# Altium schematic sheet Schematic01.SchDoc
size A; SheetNumber: 1; SheetTotal: 2
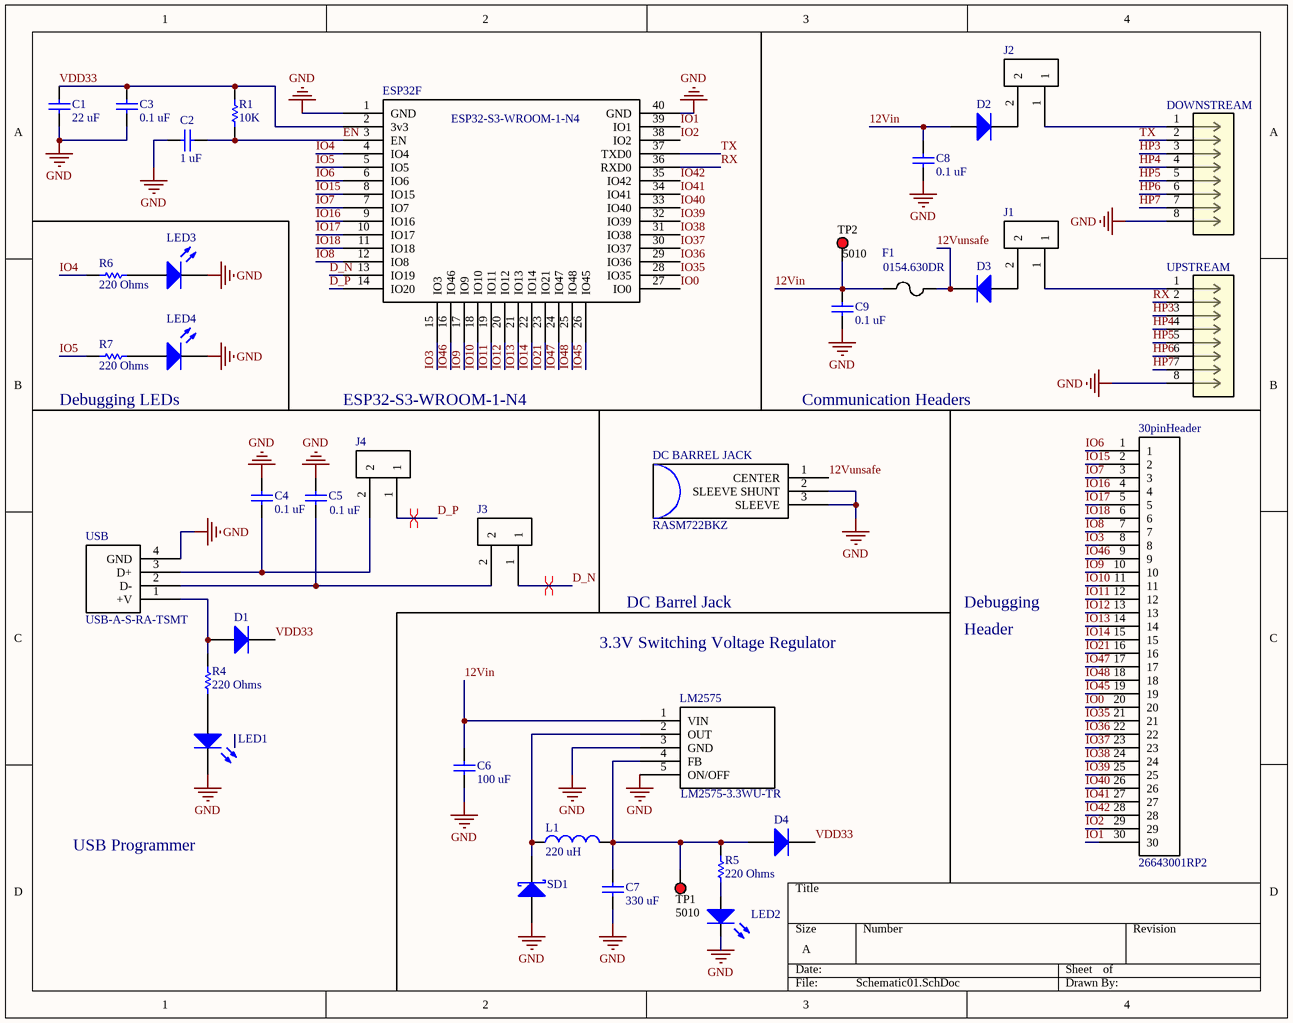
[diagram p0: Schematic01.SchDoc]

## Parts
30pinHeader  26643001RP2
C1  value 22 uF
C2  value 1 uF  (hidden comment: Capacitor)
C3  value 0.1 uF  (hidden comment: Capacitor)
C4  value 0.1 uF  (hidden comment: Capacitor)
C5  value 0.1 uF  (hidden comment: Capacitor)
C6  value 100 uF  (hidden comment: Capacitor)
C7  value 330 uF  (hidden comment: Capacitor)
C8  value 0.1 uF  (hidden comment: Capacitor)
C9  value 0.1 uF  (hidden comment: Capacitor)
D1  Diode  (value not drawn)
D2  Diode  (value not drawn)
D3  Diode  (value not drawn)
D4  Diode  (value not drawn)
DC_BARREL_JACK  RASM722BKZ
DOWNSTREAM  702460801  [CONN_7024608xx_MOL]  (value not drawn)
ESP32F  ESP32-S3-WROOM-1-N4  (value not drawn)
F1  0154.630DR  [0154Series_LTF]
J1  26640201RP2  (value not drawn)
J2  26640201RP2  (value not drawn)
J3  26640201RP2  (value not drawn)
J4  26640201RP2  (value not drawn)
L1  value 220 uH  (hidden comment: Inductor)
LED1  Light-Emitting Diode  (value not drawn)
LED2  Light-Emitting Diode  (value not drawn)
LED3  Light-Emitting Diode  (value not drawn)
LED4  Light-Emitting Diode  (value not drawn)
LM2575  LM2575-3.3WUTR  (value not drawn)
R1  value 10K  (hidden comment: Resistor)
R4  value 220 Ohms  (hidden comment: Resistor)
R5  value 220 Ohms  (hidden comment: Resistor)
R6  value 220 Ohms  (hidden comment: Resistor)
R7  value 220 Ohms  (hidden comment: Resistor)
SD1  Schottky Diode  (value not drawn)
TP1  5010  [KSTN-5010_V]
TP2  5010  [KSTN-5010_V]
UPSTREAM  702460801  [CONN_7024608xx_MOL]  (value not drawn)
USB  USB-A-S-RA-TSMT

## Nets
GND: C1.1 C2.1 C3.1 C4.2 C5.2 C6.1 C7.1 C8.1 C9.1 DC_BARREL_JACK.2(SLEEVE_SHUNT) DC_BARREL_JACK.3(SLEEVE) DOWNSTREAM.8 ESP32F.1(GND) ESP32F.40(GND) LED1.2(K) LED2.2(K) LED3.2(K) LED4.2(K) LM2575.3(GND) LM2575.5(ON/OFF) SD1.1(A) UPSTREAM.8 USB.4(GND)
12Vin: C6.2 C8.2 C9.2 D2.1(A) F1.1 LM2575.1(VIN) TP2.1
12Vunsafe: D3.2(K) DC_BARREL_JACK.1(CENTER) F1.2
D_N: ESP32F.13(IO19) J3.1
D_P: ESP32F.14(IO20) J4.1
EN: C2.2 ESP32F.3(EN) R1.1
HP3: DOWNSTREAM.3 UPSTREAM.3
HP4: DOWNSTREAM.4 UPSTREAM.4
HP5: DOWNSTREAM.5 UPSTREAM.5
HP6: DOWNSTREAM.6 UPSTREAM.6
HP7: DOWNSTREAM.7 UPSTREAM.7
IO0: 30pinHeader.20 ESP32F.27(IO0)
IO1: 30pinHeader.30 ESP32F.39(IO1)
IO2: 30pinHeader.29 ESP32F.38(IO2)
IO3: 30pinHeader.8 ESP32F.15(IO3)
IO4: ESP32F.4(IO4) R6.1
IO5: ESP32F.5(IO5) R7.1
IO6: 30pinHeader.1 ESP32F.6(IO6)
IO7: 30pinHeader.3 ESP32F.7(IO7)
IO8: 30pinHeader.7 ESP32F.12(IO8)
IO9: 30pinHeader.10 ESP32F.17(IO9)
IO10: 30pinHeader.11 ESP32F.18(IO10)
IO11: 30pinHeader.12 ESP32F.19(IO11)
IO12: 30pinHeader.13 ESP32F.20(IO12)
IO13: 30pinHeader.14 ESP32F.21(IO13)
IO14: 30pinHeader.15 ESP32F.22(IO14)
IO15: 30pinHeader.2 ESP32F.8(IO15)
IO16: 30pinHeader.4 ESP32F.9(IO16)
IO17: 30pinHeader.5 ESP32F.10(IO17)
IO18: 30pinHeader.6 ESP32F.11(IO18)
IO21: 30pinHeader.16 ESP32F.23(IO21)
IO35: 30pinHeader.21 ESP32F.28(IO35)
IO36: 30pinHeader.22 ESP32F.29(IO36)
IO37: 30pinHeader.23 ESP32F.30(IO37)
IO38: 30pinHeader.24 ESP32F.31(IO38)
IO39: 30pinHeader.25 ESP32F.32(IO39)
IO40: 30pinHeader.26 ESP32F.33(IO40)
IO41: 30pinHeader.27 ESP32F.34(IO41)
IO42: 30pinHeader.28 ESP32F.35(IO42)
IO45: 30pinHeader.19 ESP32F.26(IO45)
IO46: 30pinHeader.9 ESP32F.16(IO46)
IO47: 30pinHeader.17 ESP32F.24(IO47)
IO48: 30pinHeader.18 ESP32F.25(IO48)
RX: ESP32F.36(RXD0) UPSTREAM.2
TX: DOWNSTREAM.2 ESP32F.37(TXD0)
VDD33: C1.2 C3.2 D1.2(K) D4.2(K) ESP32F.2(3v3) R1.2
NetC4_1: C4.1 J4.2 USB.3(D+)
NetC5_1: C5.1 J3.2 USB.2(D-)
NetC7_2: C7.2 D4.1(A) L1.2 LM2575.4(FB) R5.2 TP1.1
NetD1_1: D1.1(A) R4.2 USB.1(+V)
NetD2_2: D2.2(K) J2.2
NetD3_1: D3.1(A) J1.2
NetDOWNSTREAM_1: DOWNSTREAM.1 J2.1
NetJ1_1: J1.1 UPSTREAM.1
NetL1_1: L1.1 LM2575.2(OUT) SD1.2(K)
NetLED1_1: LED1.1(A) R4.1
NetLED2_1: LED2.1(A) R5.1
NetLED3_1: LED3.1(A) R6.2
NetLED4_1: LED4.1(A) R7.2

## Layout directives
differential pair: D_N, D_P

## Notes on the sheet
- Debugging LEDs
- ESP32-S3-WROOM-1-N4
- Communication Headers
- DC Barrel Jack
- Debugging
- Header
- 3.3V Switching Voltage Regulator
- USB Programmer

## Library data of the parts
30pinHeader = CMP-00006-1: Board Connector
C1-C9 = Capacitor: SimulationGenericComponent: True
D1-D4 = Diode: AF: 1; BV: 0; BV_MAX: 1e99; EG: 1.11; FC: 0.5; IBV: 0.001; ISR: 1e-14; MJSW: 0.33; NTUN: 30; TNOM: 27; XTI: 3; SimulationGenericComponent: True; CJO: 0; CJP: 0; CTA: 0; CTP: 0; FCS: 0.5; FV_MAX: 1e99; IKF: 0; IKR: 0; JSW: 0; JTUN: 0; JTUNSW: 0; KEG: 1; KF: 0; LEVEL: 1; N: 1; NBV: 1; NR: 1; NS: 1; PHP: 1; RS: 0; TCV: 0; TLEV: 0; TLEVC: 0; TM1: 0; TM2: 0; TPB: 0; TPHP: 0; TRS: 0; TRS2: 0; TT: 0; TTT1: 0; TTT2: 0; VJ: 1; XTITUN: 3; IS: 1e-14
DC_BARREL_JACK = CMP-00008-1: Connector, DC Power Jack, BKZ Locking Series, 2.0mm Surface Mount
DOWNSTREAM UPSTREAM = CMP-004-000000-1: No Description Available; Mfr_Name: Molex Connector Corporation; RefDes: RefDes; Pin Count: 8; Component Type: Standard; Source: 702460801.SchLib; Design Item ID: 702460801; Type: Type
ESP32F = CMP-00001-1: WiFi-Modul 802.11/BT 2, 4-2, 5GHz 150Mb/s
F1 = 0154.630DR: No Description Available; Mfr_Name: Littelfuse Inc
J1-J4 = CMP-00005-1: Board Connector
L1 = Inductor: SimulationGenericComponent: True
LED1-LED4 = LED: AF: 1; BV: 0; BV_MAX: 1e99; EG: 1.11; FC: 0.5; IBV: 0.001; IS: 1e-14; MJSW: 0.33; NTUN: 30; TNOM: 27; XTI: 3; SimulationGenericComponent: True; CJO: 0; CJP: 0; CTA: 0; CTP: 0; FCS: 0.5; FV_MAX: 1e99; IKF: 0; IKR: 0; ISR: 1e-14; JSW: 0; JTUN: 0; JTUNSW: 0; KEG: 1; KF: 0; LEVEL: 1; N: 1; NBV: 1; NR: 1; NS: 1; PHP: 1; RS: 0; TCV: 0; TLEV: 0; TLEVC: 0; TM1: 0; TM2: 0; TPB: 0; TPHP: 0; TRS: 0; TRS2: 0; TT: 0; TTT1: 0; TTT2: 0; VJ: 1; XTITUN: 3
LM2575 = CMP-00000-1: LM2575 Series 3.3 V 1 A 52 KHz High-Efficiency Step-Down Buck Regulator-TO-263-5
R1 R4-R7 = Resistor: TC1: 0; SimulationGenericComponent: True; TC2: 0
SD1 = Schottky Diode: AF: 1; BV: 0; BV_MAX: 1e99; EG: 1.11; FC: 0.5; IBV: 0.001; IS: 1e-14; MJSW: 0.33; NTUN: 30; TNOM: 27; XTI: 3; SimulationGenericComponent: True; CJO: 0; CJP: 0; CTA: 0; CTP: 0; FCS: 0.5; FV_MAX: 1e99; IKF: 0; IKR: 0; ISR: 1e-14; JSW: 0; JTUN: 0; JTUNSW: 0; KEG: 1; KF: 0; LEVEL: 1; N: 1; NBV: 1; NR: 1; NS: 1; PHP: 1; RS: 0; TCV: 0; TLEV: 0; TLEVC: 0; TM1: 0; TM2: 0; TPB: 0; TPHP: 0; TRS: 0; TRS2: 0; TT: 0; TTT1: 0; TTT2: 0; VJ: 1; XTITUN: 3
TP1 TP2 = CMP-00004-1: Interconnection Device; RoHS Compliant: Yes; Contact Finish - Termination: Silver (Ag); Reach SVHC Compliant: Yes; JESD-609 Code: e4; Connector Type: Interconnection Device
USB = CMP-00002-1: Conn USB 2.0 Type A F 4 POS Solder RA SMD 4 Terminal 1 Port